# Altium schematic sheet 04_MCU_Part.SchDoc
size A3; SheetNumber: 4; SheetTotal: 8
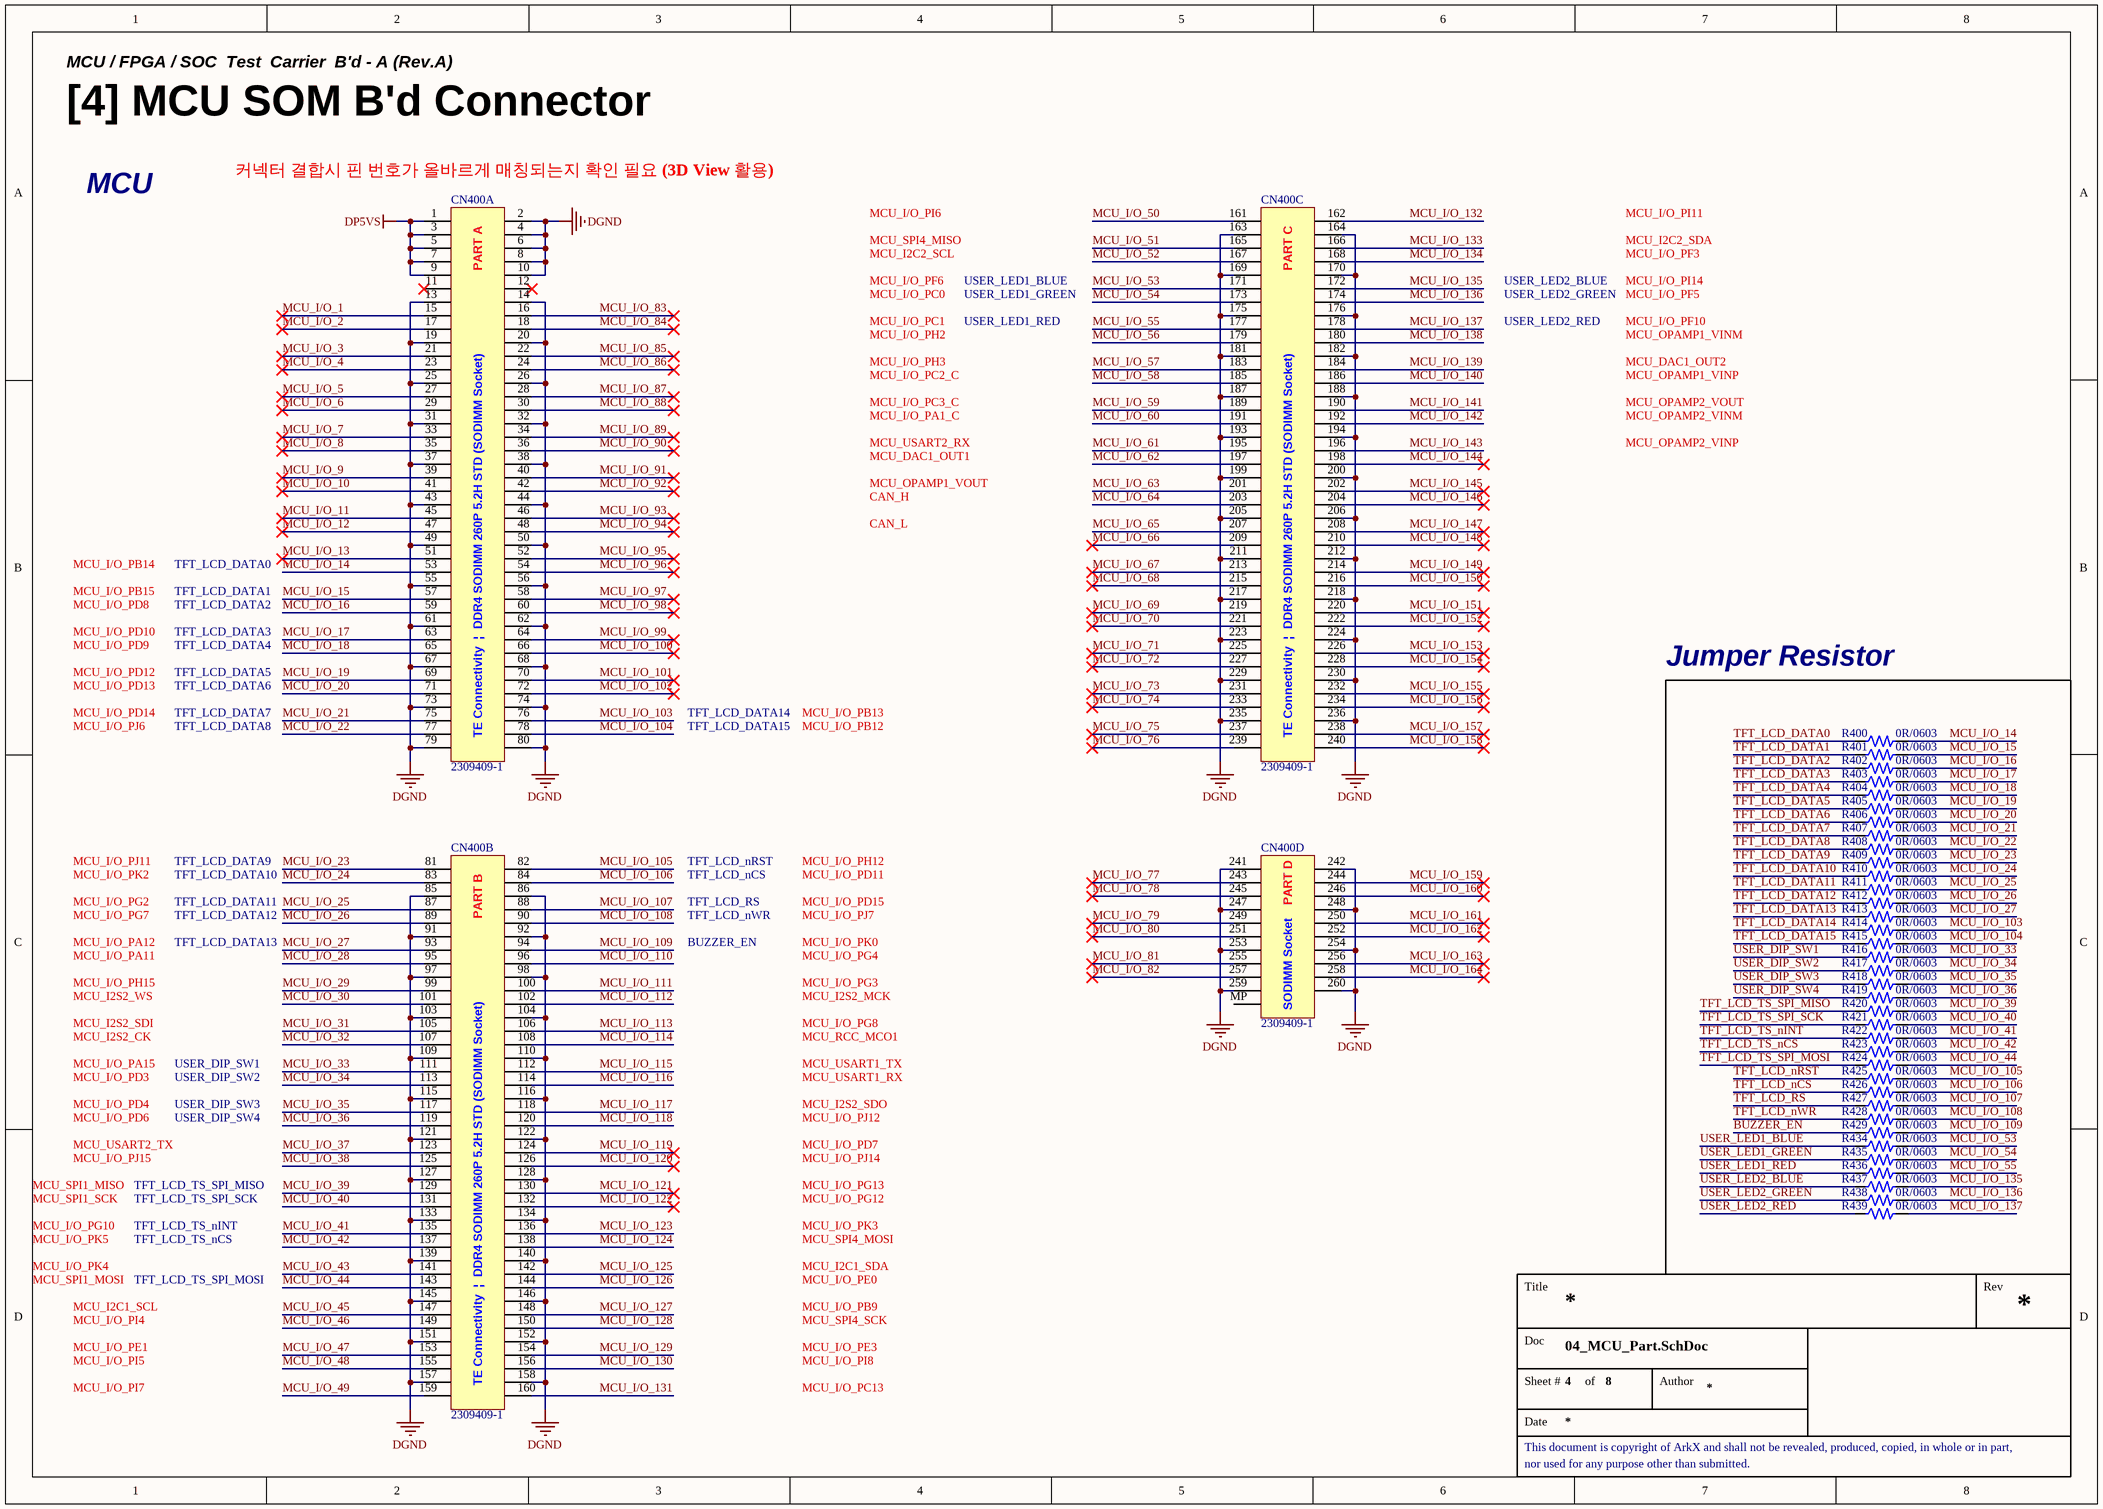
[diagram p0: 04_MCU_Part.SchDoc]

## Parts
CN400  2309409-1  [CON_SODIMM_2309409-1]  (parts A,B,C,D of 4)
R400  0R/0603  [RES 0603 (0201_inch)]
R401  0R/0603  [RES 0603 (0201_inch)]
R402  0R/0603  [RES 0603 (0201_inch)]
R403  0R/0603  [RES 0603 (0201_inch)]
R404  0R/0603  [RES 0603 (0201_inch)]
R405  0R/0603  [RES 0603 (0201_inch)]
R406  0R/0603  [RES 0603 (0201_inch)]
R407  0R/0603  [RES 0603 (0201_inch)]
R408  0R/0603  [RES 0603 (0201_inch)]
R409  0R/0603  [RES 0603 (0201_inch)]
R410  0R/0603  [RES 0603 (0201_inch)]
R411  0R/0603  [RES 0603 (0201_inch)]
R412  0R/0603  [RES 0603 (0201_inch)]
R413  0R/0603  [RES 0603 (0201_inch)]
R414  0R/0603  [RES 0603 (0201_inch)]
R415  0R/0603  [RES 0603 (0201_inch)]
R416  0R/0603  [RES 0603 (0201_inch)]
R417  0R/0603  [RES 0603 (0201_inch)]
R418  0R/0603  [RES 0603 (0201_inch)]
R419  0R/0603  [RES 0603 (0201_inch)]
R420  0R/0603  [RES 0603 (0201_inch)]
R421  0R/0603  [RES 0603 (0201_inch)]
R422  0R/0603  [RES 0603 (0201_inch)]
R423  0R/0603  [RES 0603 (0201_inch)]
R424  0R/0603  [RES 0603 (0201_inch)]
R425  0R/0603  [RES 0603 (0201_inch)]
R426  0R/0603  [RES 0603 (0201_inch)]
R427  0R/0603  [RES 0603 (0201_inch)]
R428  0R/0603  [RES 0603 (0201_inch)]
R429  0R/0603  [RES 0603 (0201_inch)]
R434  0R/0603  [RES 0603 (0201_inch)]
R435  0R/0603  [RES 0603 (0201_inch)]
R436  0R/0603  [RES 0603 (0201_inch)]
R437  0R/0603  [RES 0603 (0201_inch)]
R438  0R/0603  [RES 0603 (0201_inch)]
R439  0R/0603  [RES 0603 (0201_inch)]

## Blocks framed on the sheet
Jumper Resistor: R400-R429 R434-R439

## Nets
DGND: CN400.2 CN400.4 CN400.6 CN400.8 CN400.10 CN400.13 CN400.14 CN400.19 CN400.20 CN400.25 CN400.26 CN400.31 CN400.32 CN400.37 CN400.38 CN400.43 CN400.44 CN400.49 CN400.50 CN400.55 CN400.56 CN400.61 CN400.62 CN400.67 CN400.68 CN400.73 CN400.74 CN400.79 CN400.80 CN400.85 CN400.86 CN400.91 CN400.92 CN400.97 CN400.98 CN400.103 CN400.104 CN400.109 CN400.110 CN400.115 CN400.116 CN400.121 CN400.122 CN400.127 CN400.128 CN400.133 CN400.134 CN400.139 CN400.140 CN400.145 CN400.146 CN400.151 CN400.152 CN400.157 CN400.158 CN400.163 CN400.164 CN400.169 CN400.170 CN400.175 CN400.176 CN400.181 CN400.182 CN400.187 CN400.188 CN400.193 CN400.194 CN400.199 CN400.200 CN400.205 CN400.206 CN400.211 CN400.212 CN400.217 CN400.218 CN400.223 CN400.224 CN400.229 CN400.230 CN400.235 CN400.236 CN400.241 CN400.242 CN400.247 CN400.248 CN400.253 CN400.254 CN400.259 CN400.260
DP5VS: CN400.1 CN400.3 CN400.5 CN400.7 CN400.9
BUZZER_EN: R429.1
MCU_I/O_1: CN400.15
MCU_I/O_2: CN400.17
MCU_I/O_3: CN400.21
MCU_I/O_4: CN400.23
MCU_I/O_5: CN400.27
MCU_I/O_6: CN400.29
MCU_I/O_7: CN400.33
MCU_I/O_8: CN400.35
MCU_I/O_9: CN400.39
MCU_I/O_10: CN400.41
MCU_I/O_11: CN400.45
MCU_I/O_12: CN400.47
MCU_I/O_13: CN400.51
MCU_I/O_14: CN400.53 R400.2
MCU_I/O_15: CN400.57 R401.2
MCU_I/O_16: CN400.59 R402.2
MCU_I/O_17: CN400.63 R403.2
MCU_I/O_18: CN400.65 R404.2
MCU_I/O_19: CN400.69 R405.2
MCU_I/O_20: CN400.71 R406.2
MCU_I/O_21: CN400.75 R407.2
MCU_I/O_22: CN400.77 R408.2
MCU_I/O_23: CN400.81 R409.2
MCU_I/O_24: CN400.83 R410.2
MCU_I/O_25: CN400.87 R411.2
MCU_I/O_26: CN400.89 R412.2
MCU_I/O_27: CN400.93 R413.2
MCU_I/O_28: CN400.95
MCU_I/O_29: CN400.99
MCU_I/O_30: CN400.101
MCU_I/O_31: CN400.105
MCU_I/O_32: CN400.107
MCU_I/O_33: CN400.111 R416.2
MCU_I/O_34: CN400.113 R417.2
MCU_I/O_35: CN400.117 R418.2
MCU_I/O_36: CN400.119 R419.2
MCU_I/O_37: CN400.123
MCU_I/O_38: CN400.125
MCU_I/O_39: CN400.129 R420.2
MCU_I/O_40: CN400.131 R421.2
MCU_I/O_41: CN400.135 R422.2
MCU_I/O_42: CN400.137 R423.2
MCU_I/O_43: CN400.141
MCU_I/O_44: CN400.143 R424.2
MCU_I/O_45: CN400.147
MCU_I/O_46: CN400.149
MCU_I/O_47: CN400.153
MCU_I/O_48: CN400.155
MCU_I/O_49: CN400.159
MCU_I/O_50: CN400.161
MCU_I/O_51: CN400.165
MCU_I/O_52: CN400.167
MCU_I/O_53: CN400.171 R434.2
MCU_I/O_54: CN400.173 R435.2
MCU_I/O_55: CN400.177 R436.2
MCU_I/O_56: CN400.179
MCU_I/O_57: CN400.183
MCU_I/O_58: CN400.185
MCU_I/O_59: CN400.189
MCU_I/O_60: CN400.191
MCU_I/O_61: CN400.195
MCU_I/O_62: CN400.197
MCU_I/O_63: CN400.201
MCU_I/O_64: CN400.203
MCU_I/O_65: CN400.207
MCU_I/O_66: CN400.209
MCU_I/O_67: CN400.213
MCU_I/O_68: CN400.215
MCU_I/O_69: CN400.219
MCU_I/O_70: CN400.221
MCU_I/O_71: CN400.225
MCU_I/O_72: CN400.227
MCU_I/O_73: CN400.231
MCU_I/O_74: CN400.233
MCU_I/O_75: CN400.237
MCU_I/O_76: CN400.239
MCU_I/O_77: CN400.243
MCU_I/O_78: CN400.245
MCU_I/O_79: CN400.249
MCU_I/O_80: CN400.251
MCU_I/O_81: CN400.255
MCU_I/O_82: CN400.257
MCU_I/O_83: CN400.16
MCU_I/O_84: CN400.18
MCU_I/O_85: CN400.22
MCU_I/O_86: CN400.24
MCU_I/O_87: CN400.28
MCU_I/O_88: CN400.30
MCU_I/O_89: CN400.34
MCU_I/O_90: CN400.36
MCU_I/O_91: CN400.40
MCU_I/O_92: CN400.42
MCU_I/O_93: CN400.46
MCU_I/O_94: CN400.48
MCU_I/O_95: CN400.52
MCU_I/O_96: CN400.54
MCU_I/O_97: CN400.58
MCU_I/O_98: CN400.60
MCU_I/O_99: CN400.64
MCU_I/O_100: CN400.66
MCU_I/O_101: CN400.70
MCU_I/O_102: CN400.72
MCU_I/O_103: CN400.76 R414.2
MCU_I/O_104: CN400.78 R415.2
MCU_I/O_105: CN400.82 R425.2
MCU_I/O_106: CN400.84 R426.2
MCU_I/O_107: CN400.88 R427.2
MCU_I/O_108: CN400.90 R428.2
MCU_I/O_109: CN400.94 R429.2
MCU_I/O_110: CN400.96
MCU_I/O_111: CN400.100
MCU_I/O_112: CN400.102
MCU_I/O_113: CN400.106
MCU_I/O_114: CN400.108
MCU_I/O_115: CN400.112
MCU_I/O_116: CN400.114
MCU_I/O_117: CN400.118
MCU_I/O_118: CN400.120
MCU_I/O_119: CN400.124
MCU_I/O_120: CN400.126
MCU_I/O_121: CN400.130
MCU_I/O_122: CN400.132
MCU_I/O_123: CN400.136
MCU_I/O_124: CN400.138
MCU_I/O_125: CN400.142
MCU_I/O_126: CN400.144
MCU_I/O_127: CN400.148
MCU_I/O_128: CN400.150
MCU_I/O_129: CN400.154
MCU_I/O_130: CN400.156
MCU_I/O_131: CN400.160
MCU_I/O_132: CN400.162
MCU_I/O_133: CN400.166
MCU_I/O_134: CN400.168
MCU_I/O_135: CN400.172 R437.2
MCU_I/O_136: CN400.174 R438.2
MCU_I/O_137: CN400.178 R439.2
MCU_I/O_138: CN400.180
MCU_I/O_139: CN400.184
MCU_I/O_140: CN400.186
MCU_I/O_141: CN400.190
MCU_I/O_142: CN400.192
MCU_I/O_143: CN400.196
MCU_I/O_144: CN400.198
MCU_I/O_145: CN400.202
MCU_I/O_146: CN400.204
MCU_I/O_147: CN400.208
MCU_I/O_148: CN400.210
MCU_I/O_149: CN400.214
MCU_I/O_150: CN400.216
MCU_I/O_151: CN400.220
MCU_I/O_152: CN400.222
MCU_I/O_153: CN400.226
MCU_I/O_154: CN400.228
MCU_I/O_155: CN400.232
MCU_I/O_156: CN400.234
MCU_I/O_157: CN400.238
MCU_I/O_158: CN400.240
MCU_I/O_159: CN400.244
MCU_I/O_160: CN400.246
MCU_I/O_161: CN400.250
MCU_I/O_162: CN400.252
MCU_I/O_163: CN400.256
MCU_I/O_164: CN400.258
TFT_LCD_DATA0: R400.1
TFT_LCD_DATA1: R401.1
TFT_LCD_DATA2: R402.1
TFT_LCD_DATA3: R403.1
TFT_LCD_DATA4: R404.1
TFT_LCD_DATA5: R405.1
TFT_LCD_DATA6: R406.1
TFT_LCD_DATA7: R407.1
TFT_LCD_DATA8: R408.1
TFT_LCD_DATA9: R409.1
TFT_LCD_DATA10: R410.1
TFT_LCD_DATA11: R411.1
TFT_LCD_DATA12: R412.1
TFT_LCD_DATA13: R413.1
TFT_LCD_DATA14: R414.1
TFT_LCD_DATA15: R415.1
TFT_LCD_nCS: R426.1
TFT_LCD_nRST: R425.1
TFT_LCD_nWR: R428.1
TFT_LCD_RS: R427.1
TFT_LCD_TS_nCS: R423.1
TFT_LCD_TS_nINT: R422.1
TFT_LCD_TS_SPI_MISO: R420.1
TFT_LCD_TS_SPI_MOSI: R424.1
TFT_LCD_TS_SPI_SCK: R421.1
USER_DIP_SW1: R416.1
USER_DIP_SW2: R417.1
USER_DIP_SW3: R418.1
USER_DIP_SW4: R419.1
USER_LED1_BLUE: R434.1
USER_LED1_GREEN: R435.1
USER_LED1_RED: R436.1
USER_LED2_BLUE: R437.1
USER_LED2_GREEN: R438.1
USER_LED2_RED: R439.1

Not connected (* = marked no-connect by the designer): CN400 11* 12* MP

## Notes on the sheet
- MCU / FPGA / SOC  Test  Carrier  B'd - A (Rev.A)
- [4] MCU SOM B'd Connector
- (near CN400) 커넥터 결합시 핀 번호가 올바르게 매칭되는지 확인 필요 (3D View 활용)
- MCU
- MCU_I/O_PI6
- MCU_SPI4_MISO
- MCU_I/O_PI11
- MCU_I2C2_SDA
- MCU_I2C2_SCL
- MCU_I/O_PF6
- MCU_I/O_PC0
- USER_LED1_BLUE
- USER_LED1_GREEN
- USER_LED2_BLUE
- USER_LED2_GREEN
- MCU_I/O_PF3
- MCU_I/O_PI14
- MCU_I/O_PF5
- MCU_I/O_PC1
- MCU_I/O_PH2
- MCU_I/O_PH3
- MCU_I/O_PC2_C
- USER_LED1_RED
- USER_LED2_RED
- MCU_I/O_PF10
- MCU_OPAMP1_VINM
- MCU_DAC1_OUT2
- MCU_OPAMP1_VINP
- MCU_I/O_PC3_C
- MCU_I/O_PA1_C
- MCU_USART2_RX
- MCU_OPAMP2_VOUT
- MCU_OPAMP2_VINM
- MCU_OPAMP2_VINP
- MCU_DAC1_OUT1
- MCU_OPAMP1_VOUT
- CAN_H
- MCU_I/O_PB14
- TFT_LCD_DATA0
- CAN_L
- MCU_I/O_PB15
- MCU_I/O_PD8
- MCU_I/O_PD10
- MCU_I/O_PD9
- TFT_LCD_DATA1
- TFT_LCD_DATA2
- TFT_LCD_DATA3
- TFT_LCD_DATA4
- MCU_I/O_PD12
- MCU_I/O_PD13
- MCU_I/O_PD14
- TFT_LCD_DATA5
- TFT_LCD_DATA6
- TFT_LCD_DATA7
- TFT_LCD_DATA14
- MCU_I/O_PB13
- MCU_I/O_PJ6
- TFT_LCD_DATA8
- TFT_LCD_DATA15
- MCU_I/O_PB12
- MCU_I/O_PJ11
- MCU_I/O_PK2
- MCU_I/O_PG2
- MCU_I/O_PG7
- TFT_LCD_DATA9
- TFT_LCD_DATA10
- TFT_LCD_DATA11
- TFT_LCD_DATA12
- TFT_LCD_nRST
- TFT_LCD_nCS
- TFT_LCD_RS
- TFT_LCD_nWR
- MCU_I/O_PH12
- MCU_I/O_PD11
- MCU_I/O_PD15
- MCU_I/O_PJ7
- MCU_I/O_PA12
- MCU_I/O_PA11
- MCU_I/O_PH15
- TFT_LCD_DATA13
- BUZZER_EN
- MCU_I/O_PK0
- MCU_I/O_PG4
- MCU_I/O_PG3
- MCU_I2S2_WS
- MCU_I2S2_SDI
- MCU_I2S2_CK
- MCU_I2S2_MCK
- MCU_I/O_PG8
- MCU_RCC_MCO1
- MCU_I/O_PA15
- MCU_I/O_PD3
- MCU_I/O_PD4
- MCU_I/O_PD6
- USER_DIP_SW1
- USER_DIP_SW2
- USER_DIP_SW3
- USER_DIP_SW4
- MCU_USART1_TX
- MCU_USART1_RX
- MCU_I2S2_SDO
- MCU_I/O_PJ12
- MCU_SPI1_MISO
- MCU_USART2_TX
- MCU_I/O_PJ15
- TFT_LCD_TS_SPI_MISO
- MCU_I/O_PD7
- MCU_I/O_PJ14
- MCU_I/O_PG13
- MCU_SPI1_SCK
- MCU_I/O_PG10
- MCU_I/O_PK5
- TFT_LCD_TS_SPI_SCK
- TFT_LCD_TS_nINT
- TFT_LCD_TS_nCS
- MCU_I/O_PG12
- MCU_I/O_PK3
- MCU_SPI4_MOSI
- MCU_I/O_PK4
- MCU_SPI1_MOSI
- MCU_I2C1_SCL
- MCU_I/O_PI4
- TFT_LCD_TS_SPI_MOSI
- MCU_I2C1_SDA
- MCU_I/O_PE0
- MCU_I/O_PB9
- MCU_SPI4_SCK
- MCU_I/O_PE1
- MCU_I/O_PI5
- MCU_I/O_PI7
- MCU_I/O_PE3
- MCU_I/O_PI8
- MCU_I/O_PC13
- Title
- Rev
- Doc
- Sheet #
- of
- Author
- This document is copyright of ArkX and shall not be revealed, produced, copied, in whole or in part,
- Date
- nor used for any purpose other than submitted.
- (in symbol CON_SODIMM_2309409-1, part A) PART A; TE Connectivity  |  DDR4 SODIMM 260P 5.2H STD (SODIMM Socket)
- (in symbol CON_SODIMM_2309409-1, part B) PART B; TE Connectivity  |  DDR4 SODIMM 260P 5.2H STD (SODIMM Socket)
- (in symbol CON_SODIMM_2309409-1, part C) PART C; TE Connectivity  |  DDR4 SODIMM 260P 5.2H STD (SODIMM Socket)
- (in symbol CON_SODIMM_2309409-1, part D) PART D; SODIMM Socket

## Library data of the parts
CN400 = CON_SODIMM_2309409-1: SO DIMM Socket, Small Outline (SO), Stack Height .205 in [5.2 mm], Right Angle Module Orientation, 260 Position, DDR4 DIMM; Manufacturer: TE Connectivity; Manufacturer Part Number: 2309409-1; JLCPCB Part Type: Extended Part; LCSC Part #: C5164025
R400-R429 R434-R439 = RES_0R/0603/50mW: 50mW Thick Film Resistors 25V ±1% 0Ω 0201  Chip Resistor - Surface Mount ROHS; Value: 0R; Size: 0603; Power Rating: 50mW; Precision: 1%; LCSC Part #: C106227; JLCPCB Part Type: Extended Part